# Altium schematic sheet MC_power_en.SchDoc
size A
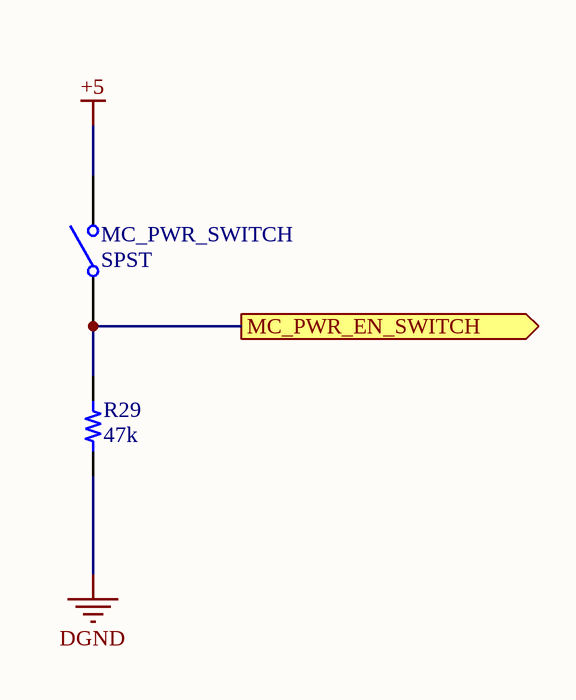
[diagram p0: MC_power_en.SchDoc]

## Parts
MC_PWR_SWITCH  SPST  [M2011SS1W01/UC]
R29  value 47k  [RES 0805/2012]  (hidden comment: Resistor 47k 0805 1/4W 10%)

## Ports
MC_PWR_EN_SWITCH (out)

## Nets
+5: MC_PWR_SWITCH.2(NO)
DGND: R29.1
MC_PWR_EN_SWITCH: MC_PWR_SWITCH.1(COMMON) R29.2 ; port MC_PWR_EN_SWITCH

## Library data of the parts
MC_PWR_SWITCH = 4: Manufacturer_id: 1; MfrPartNo: M2011SS1W01_UC; idTable: 4; Name: M2011SS1W01_UC_SPST_Switch; Voltage_Rating: 125 V; Drawer_id: 1; Link: https://www.digikey.com/product-detail/en/nkk-switches/M2011SS1W01-UC/360-3289-ND/2105194; ComponentLink1Description: Datasheet; ComponentLink1URL: https://www.nkkswitches.com/pdf/MtogglesBushing.pdf
R29 = 2541: Manufacturer_id: 1; idResistor: 2541; Name: Res_47k_0805_1/4W_10%; Created_By: Nick Mah; Supplier 1: Digi-Key; Drawer_id: 1; Tolerance: 10%; Power: 1/4W; Package: 0805; ComponentLink1Description: Datasheet; Created_Date: 2018-10-20